# Altium schematic sheet led_PA.SchDoc
size A4
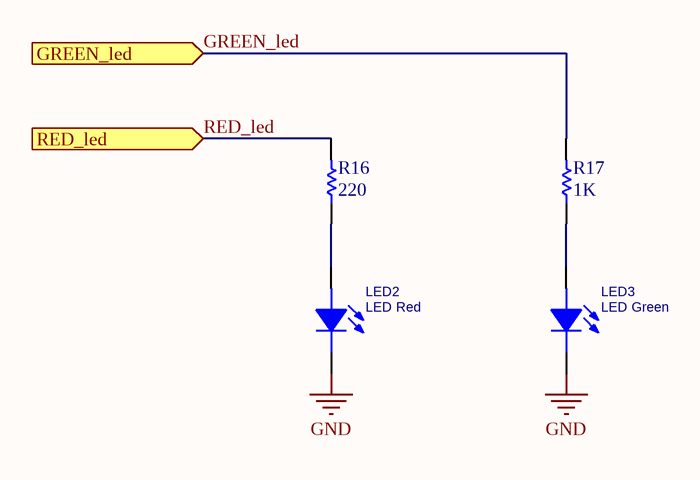
[diagram p0: led_PA.SchDoc]

## Parts
LED2  LED Red  [led_0805]
LED3  LED Green  [led_0805]
R16  220  [RES 0805 (2012X06L)]
R17  1K  [RES 0805 (2012X06L)]

## Ports
GREEN_led (in), RED_led (in)

## Nets
GND: LED2.2(CATHODE) LED3.2(CATHODE)
GREEN_led: R17.2 ; port GREEN_led
RED_led: R16.2 ; port RED_led
NetLED2_1: LED2.1(ANODE) R16.1
NetLED3_1: LED3.1(ANODE) R17.1

## Library data of the parts
LED2 LED3 = LED 5MM: Light Emitting Diode; Designer: Abbas Basereh; Data: 16-12-2016; Link: *; Part.No: *
R16 R17 = RES Axial 0.25W: Designer: Abbas Basereh; Desc.: RES Axial 0.25W; Data: 4-1-2017